# EAGLE design schematic (EAGLE 9.3.1)
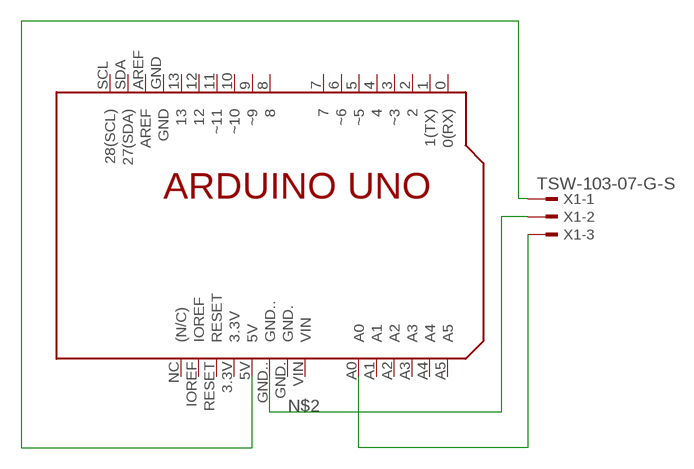
[diagram p0: schematic, sheet 1]

## Parts
U$1  ARDUINO_UNO_SHIELD"  [ARDUINO_UNO_SHIELD]
X1  TSW-103-07-G-S  [TSW-103-XX-G-S]

## Nets
N$1: U$1.5V X1.1
N$2: U$1.GND.. X1.2
N$3: U$1.A0 X1.3
Unconnected: U$1.0(0(RX)) U$1.1(1(TX)) U$1.2 U$1.3(~3) U$1.3.3V U$1.4 U$1.5(~5) U$1.6(~6) U$1.7 U$1.8 U$1.9(~9) U$1.10(~10) U$1.11(~11) U$1.12 U$1.13 U$1.A1 U$1.A2 U$1.A3 U$1.A4 U$1.A5 U$1.AREF U$1.GND U$1.GND. U$1.IOREF U$1.NC((N/C)) U$1.RESET U$1.SCL(28(SCL)) U$1.SDA(27(SDA)) U$1.VIN

## Library data of the parts
U$1 = E14_Arduino_revB:ARDUINO_UNO_SHIELD
X1 = con-samtec:TSW-103-*-G-S: THROUGH-HOLE .025" SQ POST HEADER Source: Samtec TSW.pdf; MF: Samtec Inc.; MPN: TSW-103-07-G-S

## Board
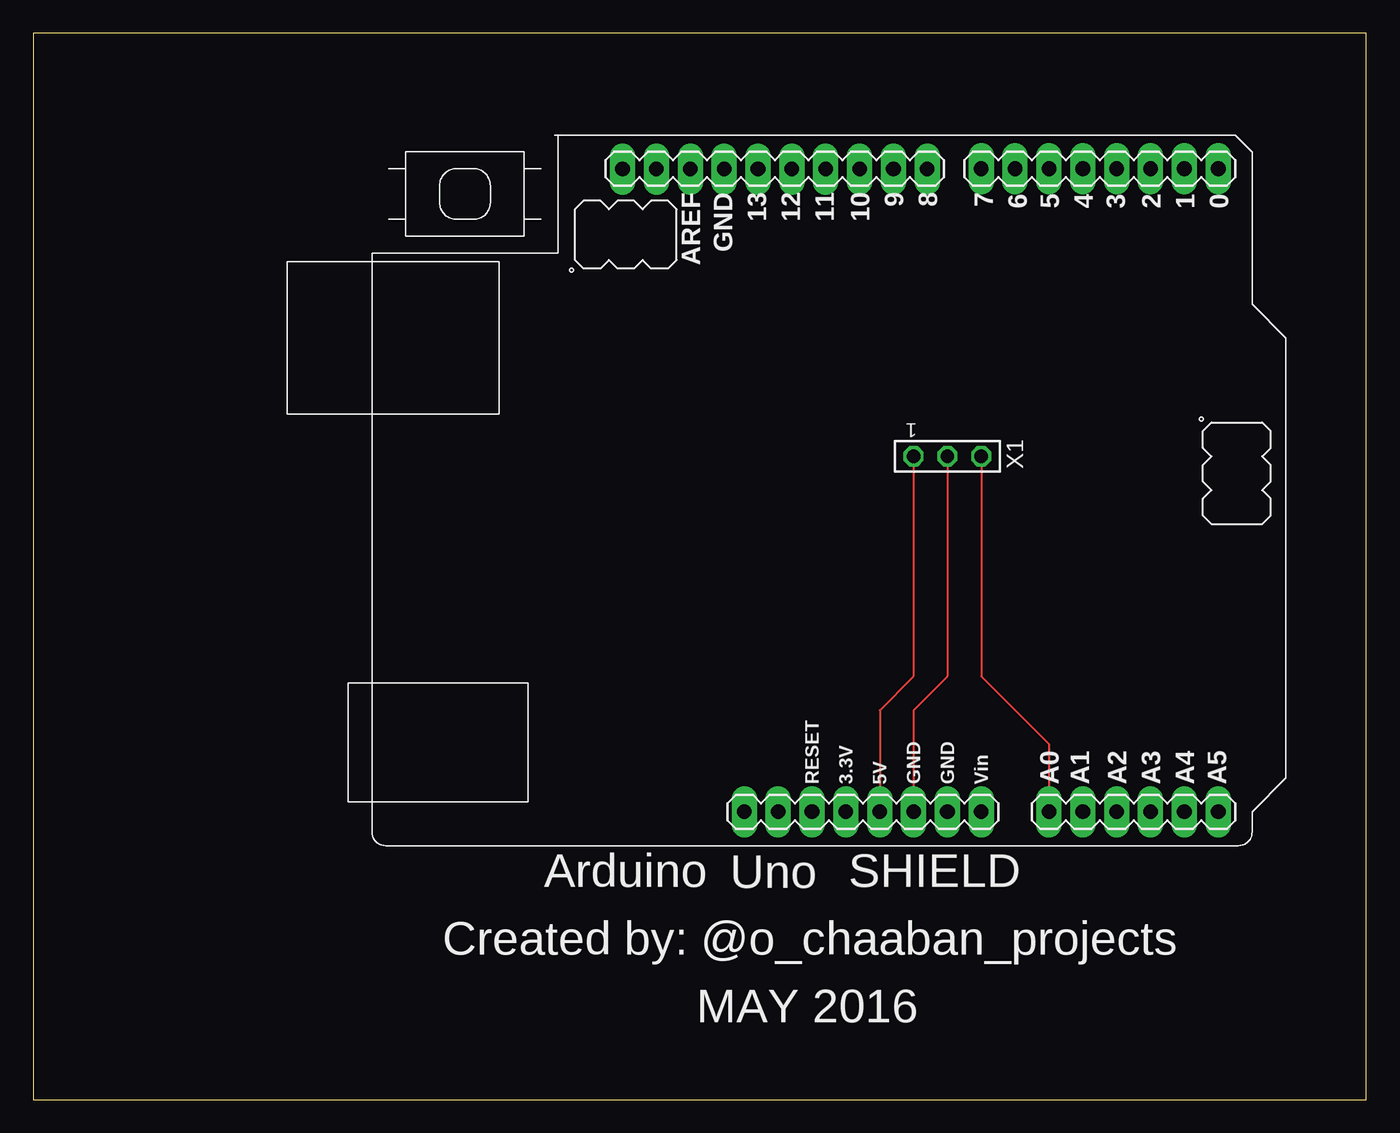
[diagram p1: board, top side]

Size 100 x 80 mm. Coordinates in mm from the lower left corner, seen from the top.
Outline: 0,0 100,0 100,80 0,80 0,0
Copper layers (1*16): Top 0.035mm / dielectric 1.5mm / Bottom 0.035mm
Design rules "default": minimum track width 6mil, minimum drill 0.35mm, track to track 6mil, track to pad 6mil, pad to pad 6mil, via to via 6mil, smd to smd 6mil, copper to edge 40mil, drill to drill 6mil, minimum pad ring 10mil, minimum via ring 8mil, stop-mask expansion 4mil, vias tented up to drill 0mil, thermal gap 10mil

### Footprints (pad centres in the part's own frame; a part is rotated, then mirrored left to right if it is on the bottom)
ARDUINO_UNO_SHIELD = drill 1.1 pad 1.93 long: 0 27.94,24.13; 1 25.4,24.13; 2 22.86,24.13; 3 20.32,24.13; 3.3V 0,-24.13; 4 17.78,24.13; 5 15.24,24.13; 5V 2.54,-24.13; 6 12.7,24.13; 7 10.16,24.13; 8 6.109,24.095; 9 3.569,24.095; 10 1.029,24.095; 11 -1.511,24.095; 12 -4.051,24.095; 13 -6.591,24.095; A0 15.24,-24.13; A1 17.78,-24.13; A2 20.32,-24.13; A3 22.86,-24.13; A4 25.4,-24.13; A5 27.94,-24.13; AREF -11.671,24.095; GND -9.131,24.095; GND. 7.62,-24.13; GND.. 5.08,-24.13; IOREF -5.08,-24.13; NC -7.62,-24.13; RESET -2.54,-24.13; SCL -16.751,24.095; SDA -14.211,24.095; VIN 10.16,-24.13
TSW-103-XX-G-S = drill 1 pad 1.5 octagon: 1 2.54,0; 2 0,0; 3 -2.54,0

### Placement (x,y rotation side)
U$1  60.96,45.72 0 top
X1  68.58,48.26 180 top

### Tracks (layer width: path | path; a pad name or v marks a point on that pad's centre or on a via)
N$1
  Top 0.152: X1.1 66.04,31.75 63.5,29.21 U$1.5V
N$2
  Top 0.152: X1.2 68.58,31.75 66.04,29.21 U$1.GND..
N$3
  Top 0.152: X1.3 71.12,31.75 76.2,26.67 U$1.A0